# EAGLE design rf95-arduino_shield (EAGLE 9.6.2)
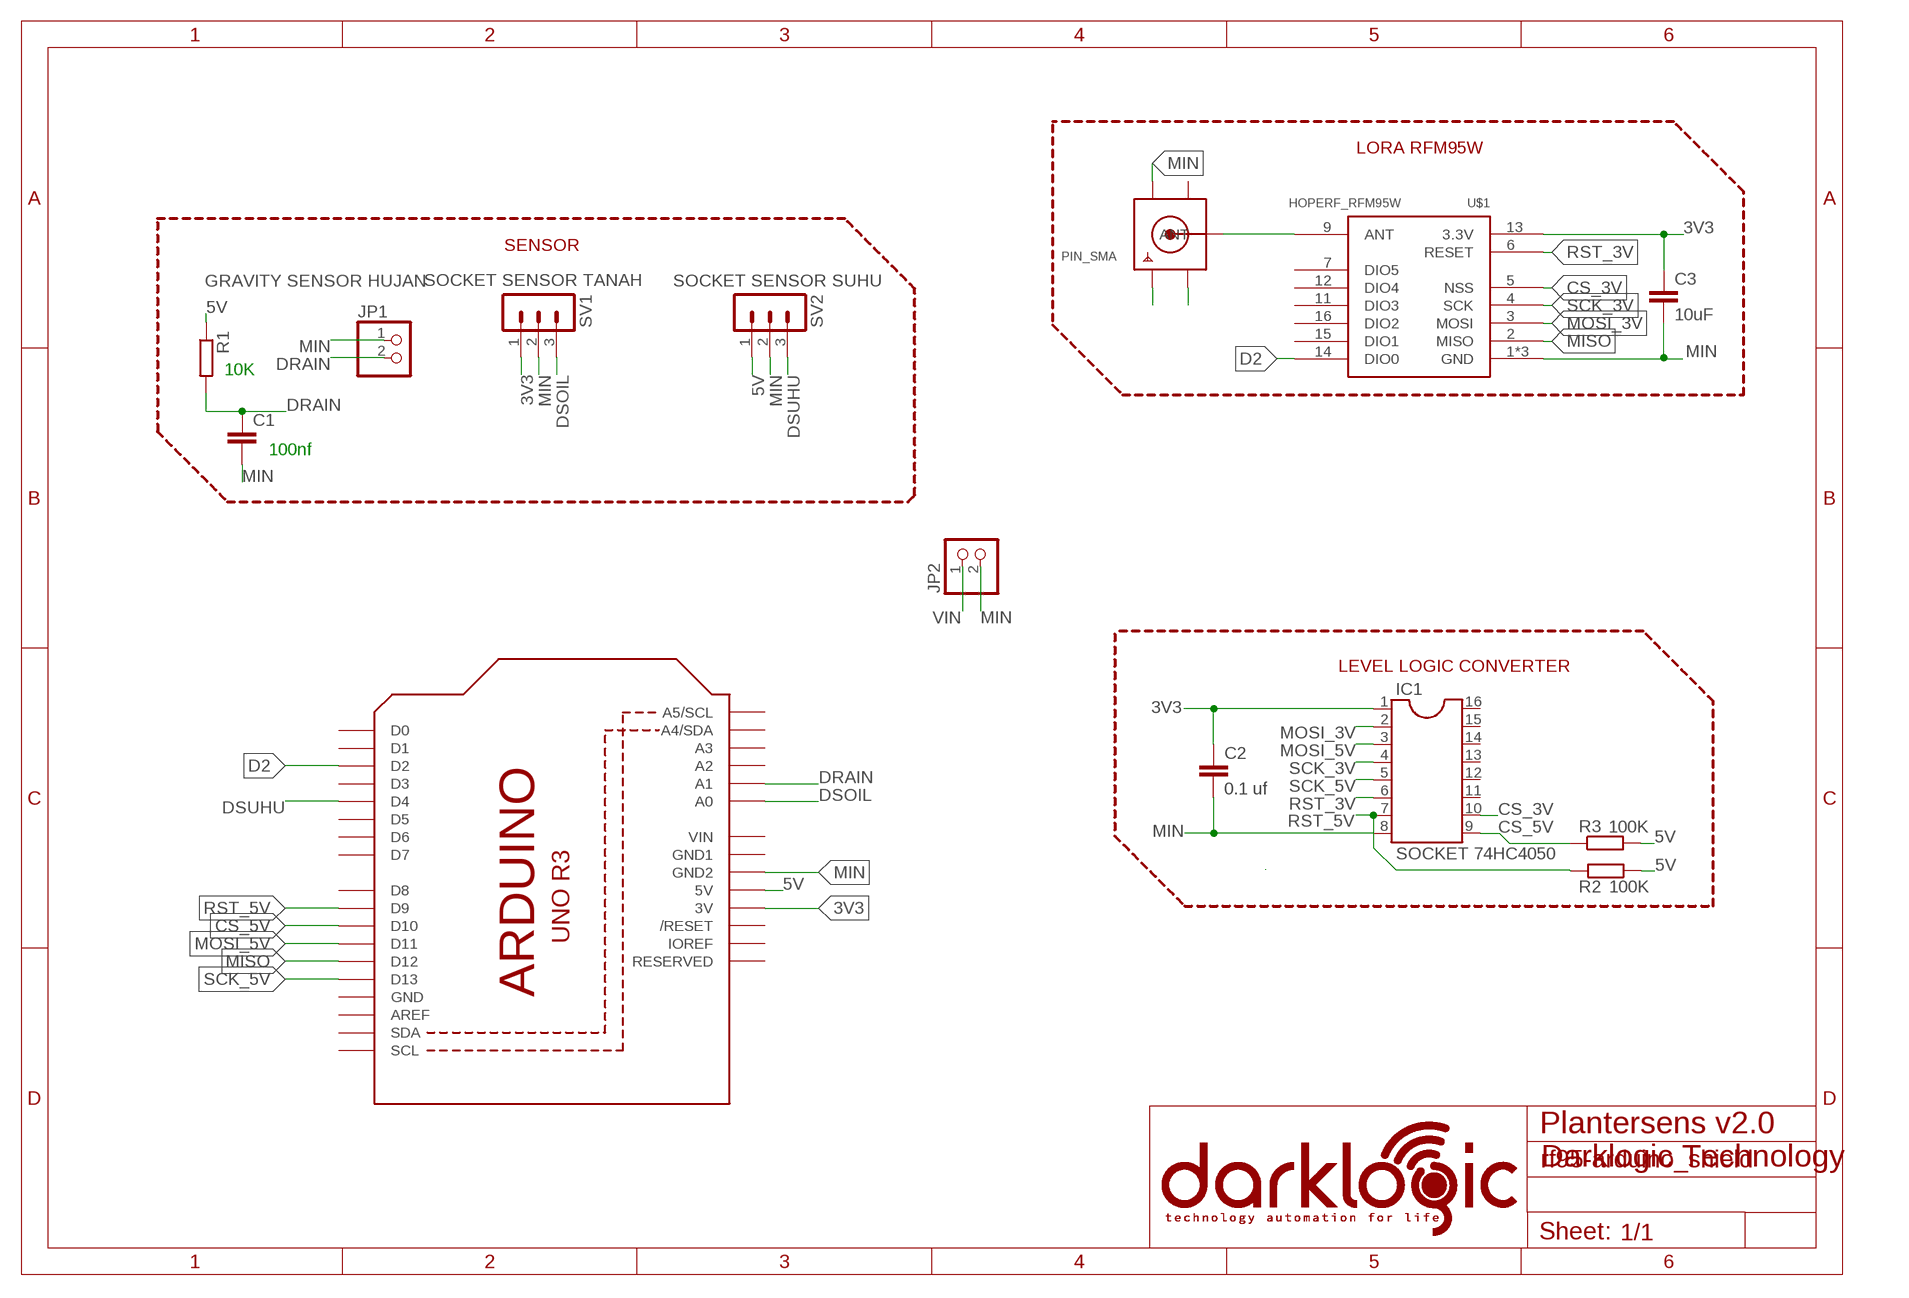
[diagram p0: schematic, sheet 1]

## Parts
C1  C2.5/2  [C2.5-2]
C2  0.1 uf  C-EU025-024X044  [C025-024X044]
C3  10uF  C-EU025-024X044  [C025-024X044]
IC1  SOCKET 74HC4050  DIL16S  [SOCKET-16]
JP1  GRAVITY SENSOR HUJAN  PINHD-1X2  [1X02]
JP2  PINHD-1X2  [1X02]
PIN_SMA  SMACONNECTOR_EDGE  [SMA_EDGELAUNCH]
R1  R-EU_0204/7  [0204/7]
R2  100K  R-EU_0204/7  [0204/7]
R3  100K  R-EU_0204/7  [0204/7]
SV1  SOCKET SENSOR TANAH  MA03-1  [MA03-1]
SV2  SOCKET SENSOR SUHU  MA03-1  [MA03-1]
U1  ARDUINOR3-BPLACE  [ARDUINOR3-BPLACE]
U$1  HOPERF_RFM95W  [HOPERF_RFM95W]

## Nets
3V3: C2.1 C3.1 IC1.1 SV1.1 U1.3V U$1.13(3.3V)
5V: R1.1 R2.1 R3.2 SV2.1 U1.5V
ANT: PIN_SMA.P(ANT) U$1.9(ANT)
CS_3V: IC1.10 U$1.5(NSS)
CS_5V: IC1.9 R3.1 U1.D10
D2: U1.D2 U$1.14(DIO0)
DRAIN: C1.1 JP1.2 R1.2 U1.A1
DSOIL: SV1.3 U1.A0
DSUHU: SV2.3 U1.D4
MIN: C1.2 C2.2 C3.2 IC1.8 JP1.1 JP2.2 PIN_SMA.GND@1(GND4) SV1.2 SV2.2 U1.GND2 U$1.1(GND) U$1.8(GND) U$1.10(GND)
MISO: U1.D12 U$1.2(MISO)
MOSI_3V: IC1.2 U$1.3(MOSI)
MOSI_5V: IC1.3 U1.D11
N$1: PIN_SMA.GND@3(GND2)
N$2: PIN_SMA.GND@4(GND1)
RST_3V: IC1.6 U$1.6(RESET)
RST_5V: IC1.7 R2.2 U1.D9
SCK_3V: IC1.4 U$1.4(SCK)
SCK_5V: IC1.5 U1.D13
VIN: JP2.1
Unconnected: IC1.11 IC1.12 IC1.13 IC1.14 IC1.15 IC1.16 U1.A2 U1.A3 U1.A4(A4/SDA) U1.A5(A5/SCL) U1.AREF U1.D0 U1.D1 U1.D3 U1.D5 U1.D6 U1.D7 U1.D8 U1.IOREF U1.RESERVED U1.RESET(/RESET) U1.SCL U1.SDA U$1.7(DIO5) U$1.11(DIO3) U$1.12(DIO4) U$1.15(DIO1) U$1.16(DIO2)

## Notes on the sheet
- LORA RFM95W
- SENSOR
- 10K
- 100nf
- LEVEL LOGIC CONVERTER
- Plantersens v2.0
- Darklogic Technology
- C:/Users/a/Documents/Dark Logic/Project/LORA/darklogic hitam copy.bmp

## Power pins joined to a net without a drawn wire
GND1: U1.GND1
GND3: PIN_SMA.GND@2(GND3)
MIN: U1.GND
VIN: U1.VIN

## Library data of the parts
C1 = capacitor-wima:C: CAPACITOR naming: grid - package width
C2 C3 = rcl:C-EU: CAPACITOR, European symbol; SPICEPREFIX: C
IC1 = ic-package:DIL16: Dual In Line / Socket
JP1 JP2 = pinhead:PINHD-1X2: PIN HEADER
PIN_SMA = adafruit:SMACONNECTOR: SMA Connector 90° DIP SMA Connector, 50 Ohm (4UConnector: 07259)
R1-R3 = rcl:R-EU_: RESISTOR, European symbol; SPICEPREFIX: R
SV1 SV2 = con-lstb:MA03-1: PIN HEADER; OC_FARNELL: unknown; OC_NEWARK: unknown
U1 = adafruit:ARDUINOR3: This is a new object for the new Arduino R3 - with extra pins that you may want to use (such as IOref, and duplicated A4/A5
U$1 = lora-lorawan-modules:HOPERF_RFM95W: HopeRF LoRaWAN modules Link: http://www.hoperf.com/rf_transceiver/lora/; HEIGHT: 1.8; LENGTH: 16; WIDTH: 16

## Board
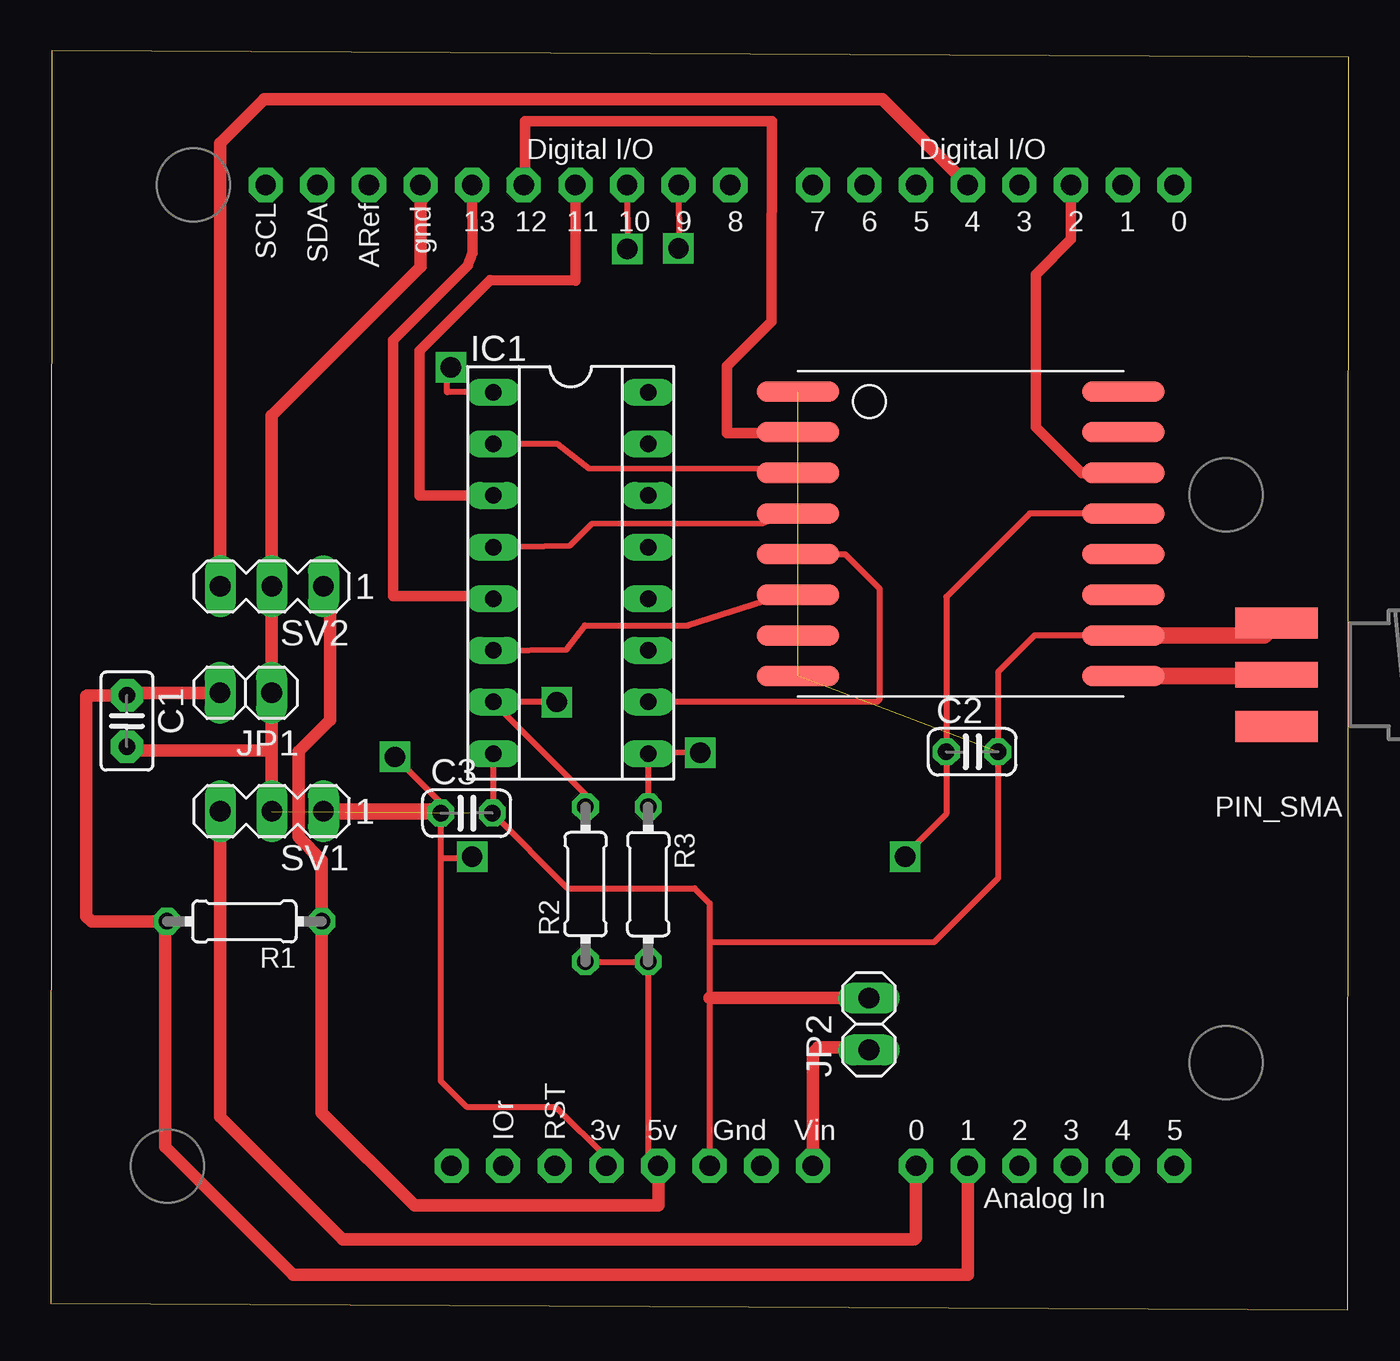
[diagram p1: board, top side]
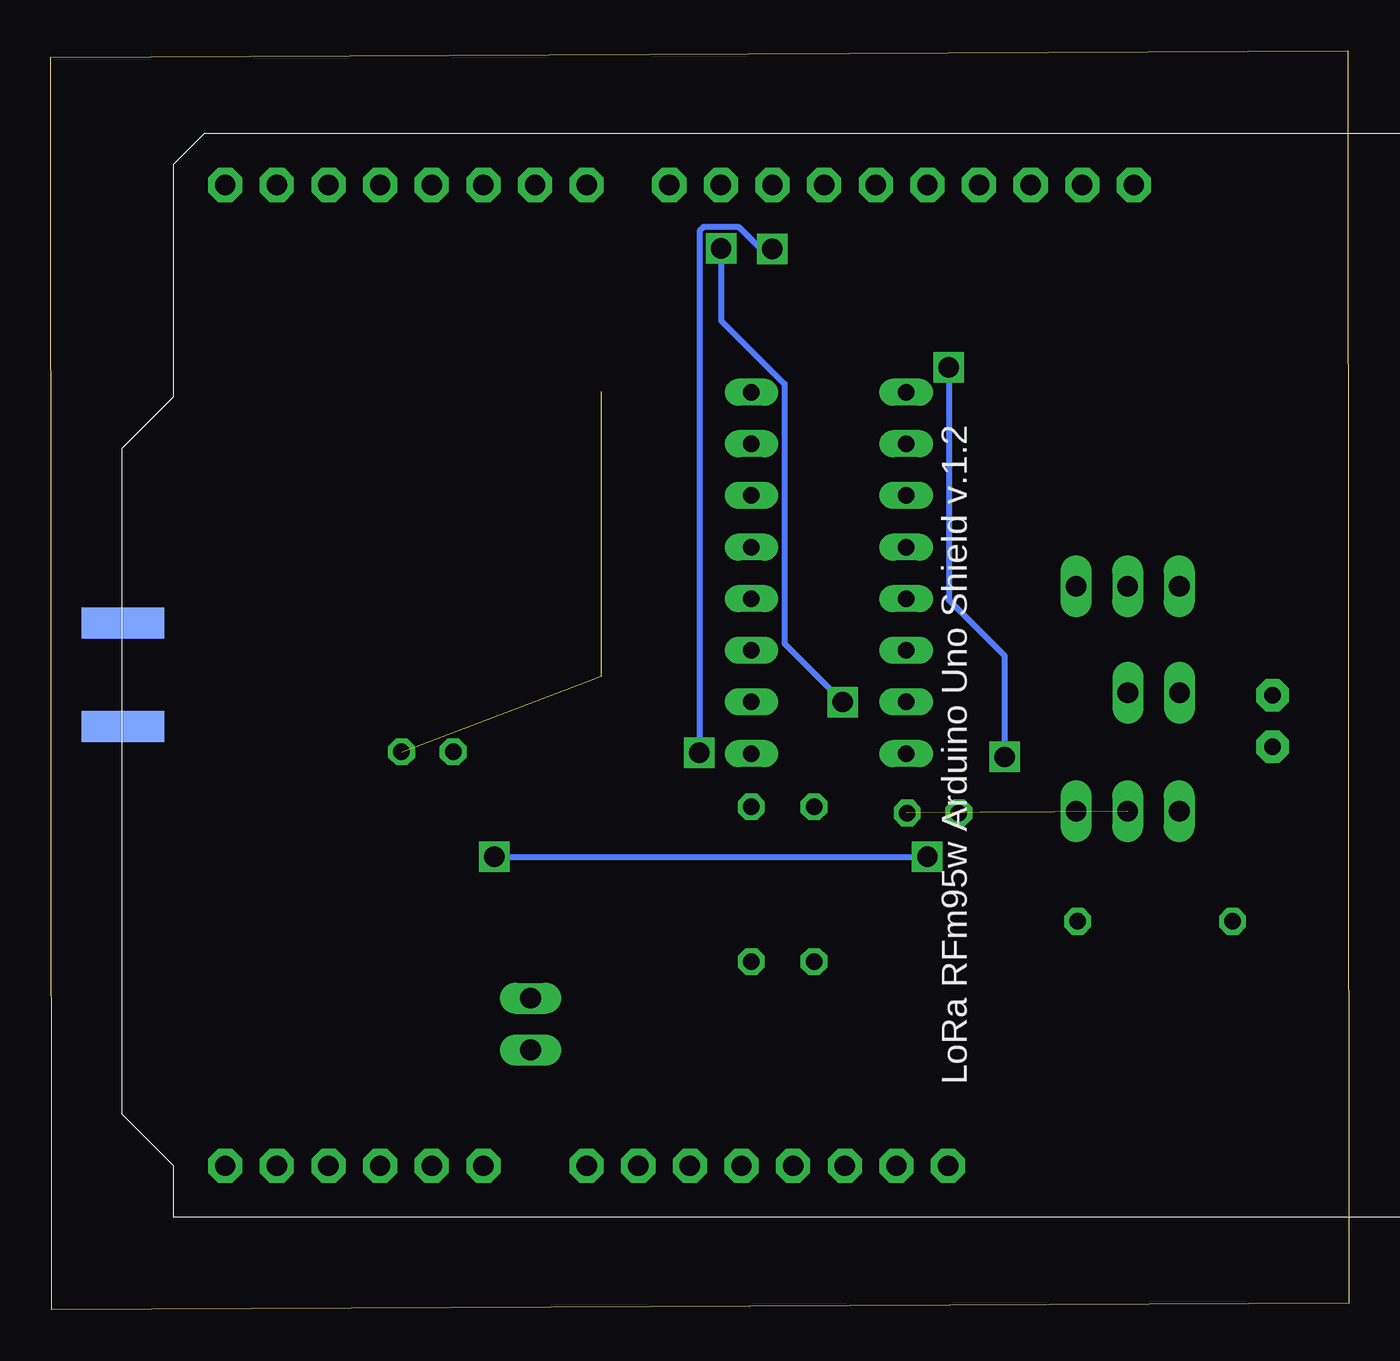
[diagram p2: board, bottom side, seen from below]

Size 63.85 x 61.95 mm. Coordinates in mm from the lower left corner, seen from the top.
Outline: 0,0.32 63.81,0 63.85,61.63 0.05,61.95 0,0.32
Copper layers (1*16): Top 0.035mm / dielectric 1.5mm / Bottom 0.035mm
Design rules "default": minimum track width 6mil, minimum drill 0.35mm, track to track 6mil, track to pad 6mil, pad to pad 6mil, via to via 6mil, smd to smd 6mil, copper to edge 40mil, drill to drill 6mil, minimum pad ring 10mil, minimum via ring 8mil, stop-mask expansion 4mil, vias tented up to drill 0mil, thermal gap 10mil

### Footprints (pad centres in the part's own frame; a part is rotated, then mirrored left to right if it is on the bottom)
C2.5-2 = drill 0.813 pad 1.6 octagon: 1 -1.27,0; 2 1.27,0
C025-024X044 = drill 0.813 octagon: 1 -1.27,0; 2 1.27,0
SOCKET-16 = drill 0.813 long: 1 -8.89,-3.81; 2 -6.35,-3.81; 3 -3.81,-3.81; 4 -1.27,-3.81; 5 1.27,-3.81; 6 3.81,-3.81; 7 6.35,-3.81; 8 8.89,-3.81; 9 8.89,3.81; 10 6.35,3.81; 11 3.81,3.81; 12 1.27,3.81; 13 -1.27,3.81; 14 -3.81,3.81; 15 -6.35,3.81; 16 -8.89,3.81
1X02 = drill 1.016 long: 1 -1.27,0; 2 1.27,0
SMA_EDGELAUNCH = smd 4.064 x 1.524: GND@1 2.032,-2.54; GND@2 2.032,2.54 | smd 4.064 x 1.524 bottom: GND@3 2.032,2.54; GND@4 2.032,-2.54 | smd 4.064 x 1.27: P 2.032,0
0204/7 = drill 0.813 octagon: 1 -3.81,0; 2 3.81,0
MA03-1 = drill 1.016 long: 1 -2.54,0; 2 0,0; 3 2.54,0
ARDUINOR3-BPLACE = drill 1 pad 1.676 octagon: 3V 35.56,2.54; 5V 38.1,2.54; A0 50.8,2.54; A1 53.34,2.54; A2 55.88,2.54; A3 58.42,2.54; A4 60.96,2.54; A5 63.5,2.54; AREF 23.876,50.8; D0 63.5,50.8; D1 60.96,50.8; D2 58.42,50.8; D3 55.88,50.8; D4 53.34,50.8; D5 50.8,50.8; D6 48.26,50.8; D7 45.72,50.8; D8 41.656,50.8; D9 39.116,50.8; D10 36.576,50.8; D11 34.036,50.8; D12 31.496,50.8; D13 28.956,50.8; GND 26.416,50.8; GND1 43.18,2.54; GND2 40.64,2.54; IOREF 30.48,2.54; RESERVED 27.94,2.54; RESET 33.02,2.54; SCL 18.796,50.8; SDA 21.336,50.8; VIN 45.72,2.54
HOPERF_RFM95W = smd 4.064 x 1.016: 1 -8.12,7.13; 2 -8.12,5.13; 3 -8.12,3.13; 4 -8.12,1.13; 5 -8.12,-0.87; 6 -8.12,-2.87; 7 -8.12,-4.87; 8 -8.12,-6.87; 9 7.88,-6.87; 10 7.88,-4.87; 11 7.88,-2.87; 12 7.88,-0.87; 13 7.88,1.13; 14 7.88,3.13; 15 7.88,5.13; 16 7.88,7.13

### Placement (x,y rotation side)
C1  3.74,28.97 270 top
C2  45.32,27.46 0 top
C3  20.45,24.44 0 top
IC1  25.57,36.26 270 top
JP1  9.59,30.37 180 top
JP2  40.25,14.07 90 top
PIN_SMA  62.34,31.25 180 top
R1  9.53,19.12 180 top
R2  26.3,20.95 90 top
R3  29.39,20.95 270 top
SV1  10.87,24.54 180 top
SV2  10.87,35.6 180 top
U1  -8.23,4.55 0 top
U$1  44.89,38.06 0 top

### Tracks (layer width: path | path; a pad name or v marks a point on that pad's centre or on a via)
3V3  (via drill 1)
  Top 0.305: U$1.13 48.16,39.19 44.05,35.09 C2.1 44.05,24.41 42.03,22.39 v42.03,22.3 | IC1.1 19.52,45.15 19.49,45.18 19.49,46.19 v19.67,46.37 | v16.93,27.21 19.18,24.96 C3.1 19.18,22.23 | 19.18,22.23 19.18,11.27 20.45,10 24.84,10 27.33,7.51 U1.3V | v20.73,22.3 20.66,22.23 19.18,22.23
  Top 0.813: SV1.1 19.09,24.54 C3.1
  Bottom 0.305: v19.67,46.37 19.67,34.94 16.93,32.19 v16.93,27.21 | v42.03,22.3 v20.73,22.3
5V
  Top 0.305: R2.1 R3.2 29.39,7.57 29.89,7.07
  Top 0.61: SV2.1 13.37,35.55 13.73,35.19 13.73,29.02 12.19,27.48 12.19,23.27 13.34,22.13 R1.1 13.34,9.71 17.89,5.15 29.89,5.15 29.89,7.07 U1.5V | SV2.1
ANT
  Top 0.813: U$1.9 60.24,31.19 PIN_SMA.P
CS_3V
  Top 0.305: U$1.5 39.07,37.19 40.77,35.49 40.77,30.05 40.64,29.91 IC1.10
CS_5V  (via drill 1)
  Top 0.305: U1.D10 v28.36,52.2 | v31.95,27.42 IC1.9 R3.1
  Bottom 0.305: v28.36,52.2 28.92,52.2 30,53.28 31.75,53.28 31.93,53.1 31.93,27.48 32.04,27.37 v31.95,27.42
D2
  Top 0.508: U1.D2 50.19,52.67 48.46,50.94 48.46,43.44 50.72,41.18 U$1.14
DRAIN
  Top 0.61: JP1.2 3.87,30.37 C1.1 1.79,30.24 1.75,30.21 1.75,19.37 2,19.12 R1.2 5.62,19.02 5.62,8.03 11.93,1.72 45.1,1.72 45.11,1.74 U1.A1
DSOIL
  Top 0.61: SV1.3 8.33,9.5 14.36,3.47 42.49,3.47 42.57,3.55 U1.A0
DSUHU
  Top 0.61: U1.D4 40.9,59.56 10.49,59.56 8.33,57.41 SV2.3
MIN  (3 unrouted)
  Top 0.305: U$1.10 48.4,33.19 46.59,31.38 C2.2 46.59,21.23 43.45,18.09 32.41,18.09 | IC1.8 21.76,24.49 C3.2 25.43,20.74 31.68,20.74 32.41,20.01 32.41,18.09 | 32.41,18.09 32.41,15.35 U1.GND2
  Top 0.61: SV2.2 | SV2.2 10.87,44.01 18.19,51.33 U1.GND | SV2.2 10.87,30.38 JP1.1 10.86,27.53 | SV1.2 10.86,27.53 | C1.2 3.91,27.53 10.86,27.53 | 32.41,15.35 40.24,15.35 JP2.2
  Top 0.813: U$1.10 59.7,33.19 PIN_SMA.GND@1
MISO
  Top 0.508: U1.D12 23.34,55.42 23.34,58.48 | 23.34,58.48 | 23.34,58.48 35.47,58.48 35.45,49.48 35.45,48.63 33.25,46.44 33.25,43.14 36.73,43.14 U$1.2
MOSI_3V
  Top 0.305: IC1.2 24.91,42.62 26.49,41.41 36.52,41.42 U$1.3
MOSI_5V
  Top 0.508: IC1.3 18.14,40.07 18.14,47.19 21.62,50.67 25.81,50.64 U1.D11
RST_3V
  Top 0.305: IC1.6 25.37,32.49 26.28,33.68 31.34,33.66 36.14,35.19 U$1.6
RST_5V  (via drill 1)
  Top 0.305: U1.D9 30.9,52.24 v30.88,52.22 | v24.89,29.91 IC1.7 26.3,25.37 R2.2
  Bottom 0.305: v30.88,52.22 30.88,48.67 27.76,45.55 27.76,32.78 v24.89,29.91
SCK_3V
  Top 0.305: IC1.4 25.55,37.61 26.62,38.69 35.01,38.71 36.33,39.26 U$1.4
SCK_5V
  Top 0.508: IC1.5 21.64,35.12 16.84,35.12 16.84,47.72 20.5,51.37 20.75,52.01 U1.D13
VIN
  Top 0.61: U1.VIN 37.49,12.68 37.73,12.92 40.12,12.92 JP2.1

### Text on the board
bNames: LoRa RFm95w Arduino Uno Shield v.1.2
Name: LoRa RF95w Arduino Shield V1.2